# Altium schematic sheet 原理图（源文件格式）.SchDoc
size A4
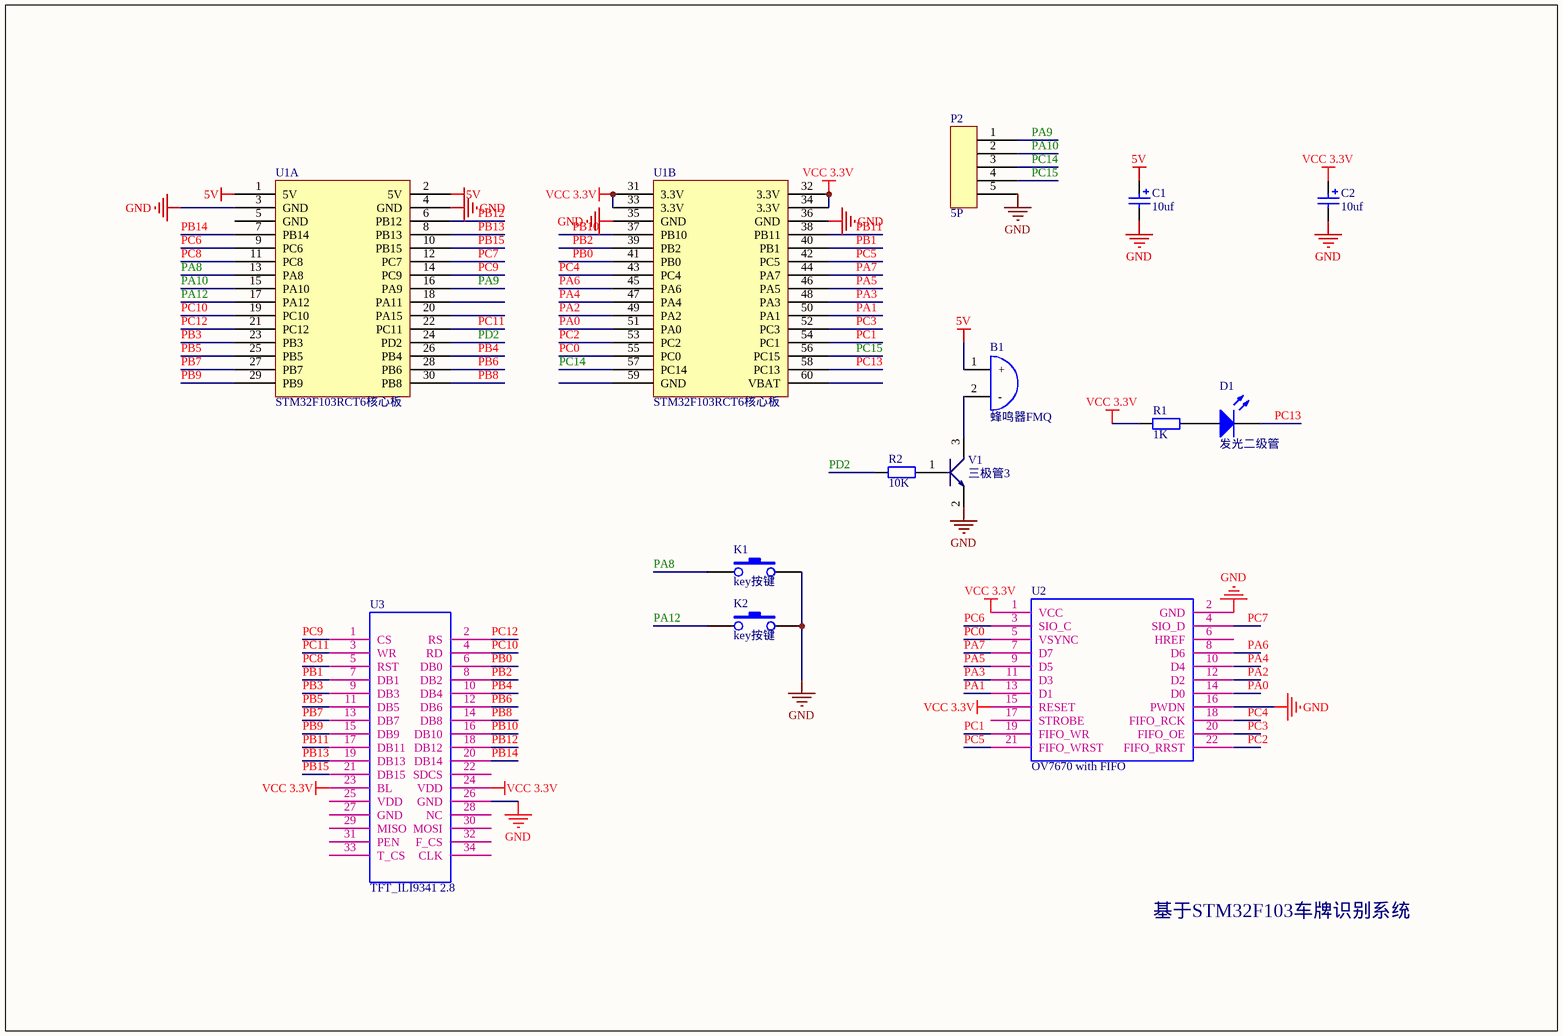
[diagram p0: 原理图（源文件格式）.SchDoc]

## Parts
B1  蜂鸣器FMQ  [蜂鸣器]
C1  10uf  [CD0.254cm]
C2  10uf  [CD0.254cm]
D1  发光二级管  [发光二极管FZ]
K1  key按键  [按键]
K2  key按键  [按键]
P2  5P  [5ZHEN-100mil]
R1  1K  [电阻FZ]
R2  10K  [电阻FZ]
U1  STM32F103RCT6核心板  [STM32F103RC/RB 核心板]  (parts A,B of 2)
U2  OV7670 with FIFO  [OV7670模块]
U3  TFT_ILI9341 2.8  [2.8寸TFT]
V1  三极管3  [三极管FZ]

## Nets
5V: B1.1(+) C1.1 U1.1(5V) U1.2(5V)
GND: C1.2 C2.2 K1.2 K2.2 P2.5 U1.3(GND) U1.4(GND) U1.35(GND) U1.36(GND) U2.2(GND) U2.16(PWDN) U3.26(GND) V1.2
VCC 3.3V: C2.1 R1.1 U1.31(3.3V) U1.32(3.3V) U1.33(3.3V) U1.34(3.3V) U2.1(VCC) U2.15(RESET) U3.23(BL) U3.24(VDD)
PA0: U1.51(PA0) U2.14(D0)
PA1: U1.50(PA1) U2.13(D1)
PA2: U1.49(PA2) U2.12(D2)
PA3: U1.48(PA3) U2.11(D3)
PA4: U1.47(PA4) U2.10(D4)
PA5: U1.46(PA5) U2.9(D5)
PA6: U1.45(PA6) U2.8(D6)
PA7: U1.44(PA7) U2.7(D7)
PA8: K1.1 U1.13(PA8)
PA9: P2.1 U1.16(PA9)
PA10: P2.2 U1.15(PA10)
PA12: K2.1 U1.17(PA12)
PB0: U1.41(PB0) U3.6(DB0)
PB1: U1.40(PB1) U3.7(DB1)
PB2: U1.39(PB2) U3.8(DB2)
PB3: U1.23(PB3) U3.9(DB3)
PB4: U1.26(PB4) U3.10(DB4)
PB5: U1.25(PB5) U3.11(DB5)
PB6: U1.28(PB6) U3.12(DB6)
PB7: U1.27(PB7) U3.13(DB7)
PB8: U1.30(PB8) U3.14(DB8)
PB9: U1.29(PB9) U3.15(DB9)
PB10: U1.37(PB10) U3.16(DB10)
PB11: U1.38(PB11) U3.17(DB11)
PB12: U1.6(PB12) U3.18(DB12)
PB13: U1.8(PB13) U3.19(DB13)
PB14: U1.7(PB14) U3.20(DB14)
PB15: U1.10(PB15) U3.21(DB15)
PC0: U1.55(PC0) U2.5(VSYNC)
PC1: U1.54(PC1) U2.19(FIFO_WR)
PC2: U1.53(PC2) U2.22(FIFO_RRST)
PC3: U1.52(PC3) U2.20(FIFO_OE)
PC4: U1.43(PC4) U2.18(FIFO_RCK)
PC5: U1.42(PC5) U2.21(FIFO_WRST)
PC6: U1.9(PC6) U2.3(SIO_C)
PC7: U1.12(PC7) U2.4(SIO_D)
PC8: U1.11(PC8) U3.5(RST)
PC9: U1.14(PC9) U3.1(CS)
PC10: U1.19(PC10) U3.4(RD)
PC11: U1.22(PC11) U3.3(WR)
PC12: U1.21(PC12) U3.2(RS)
PC13: D1.2(K) U1.58(PC13)
PC14: P2.3 U1.57(PC14)
PC15: P2.4 U1.56(PC15)
PD2: R2.1 U1.24(PD2)
NetB1_2: B1.2(-) V1.3
NetD1_1: D1.1(A) R1.2
NetR2_2: R2.2 V1.1

Not connected (* = marked no-connect by the designer): U1 5(GND) 18(PA11) 20(PA15) 59(GND) 60(VBAT); U2 6(HREF) 17(STROBE); U3 22(SDCS) 25(VDD) 27(GND) 28(NC) 29(MISO) 30(MOSI) 31(PEN) 32(F_CS) 33(T_CS) 34(CLK)

## Notes on the sheet
- 基于STM32F103车牌识别系统

## Library data of the parts
C1 C2 = 电解电容
R1 R2 = 电阻R
U2 = OV7670: FIFO; LatestRevisionDate: 17-Jul-2002; LatestRevisionNote: Re-released for DXP Platform.; Publisher: Altium Limited
U3 = TFT: ILI9341; LatestRevisionDate: 17-Jul-2002; LatestRevisionNote: Re-released for DXP Platform.; Publisher: Altium Limited